# Altium project Display Segmental LCD118x1 DF700543-05 Backlight TB1012S.PrjPCB
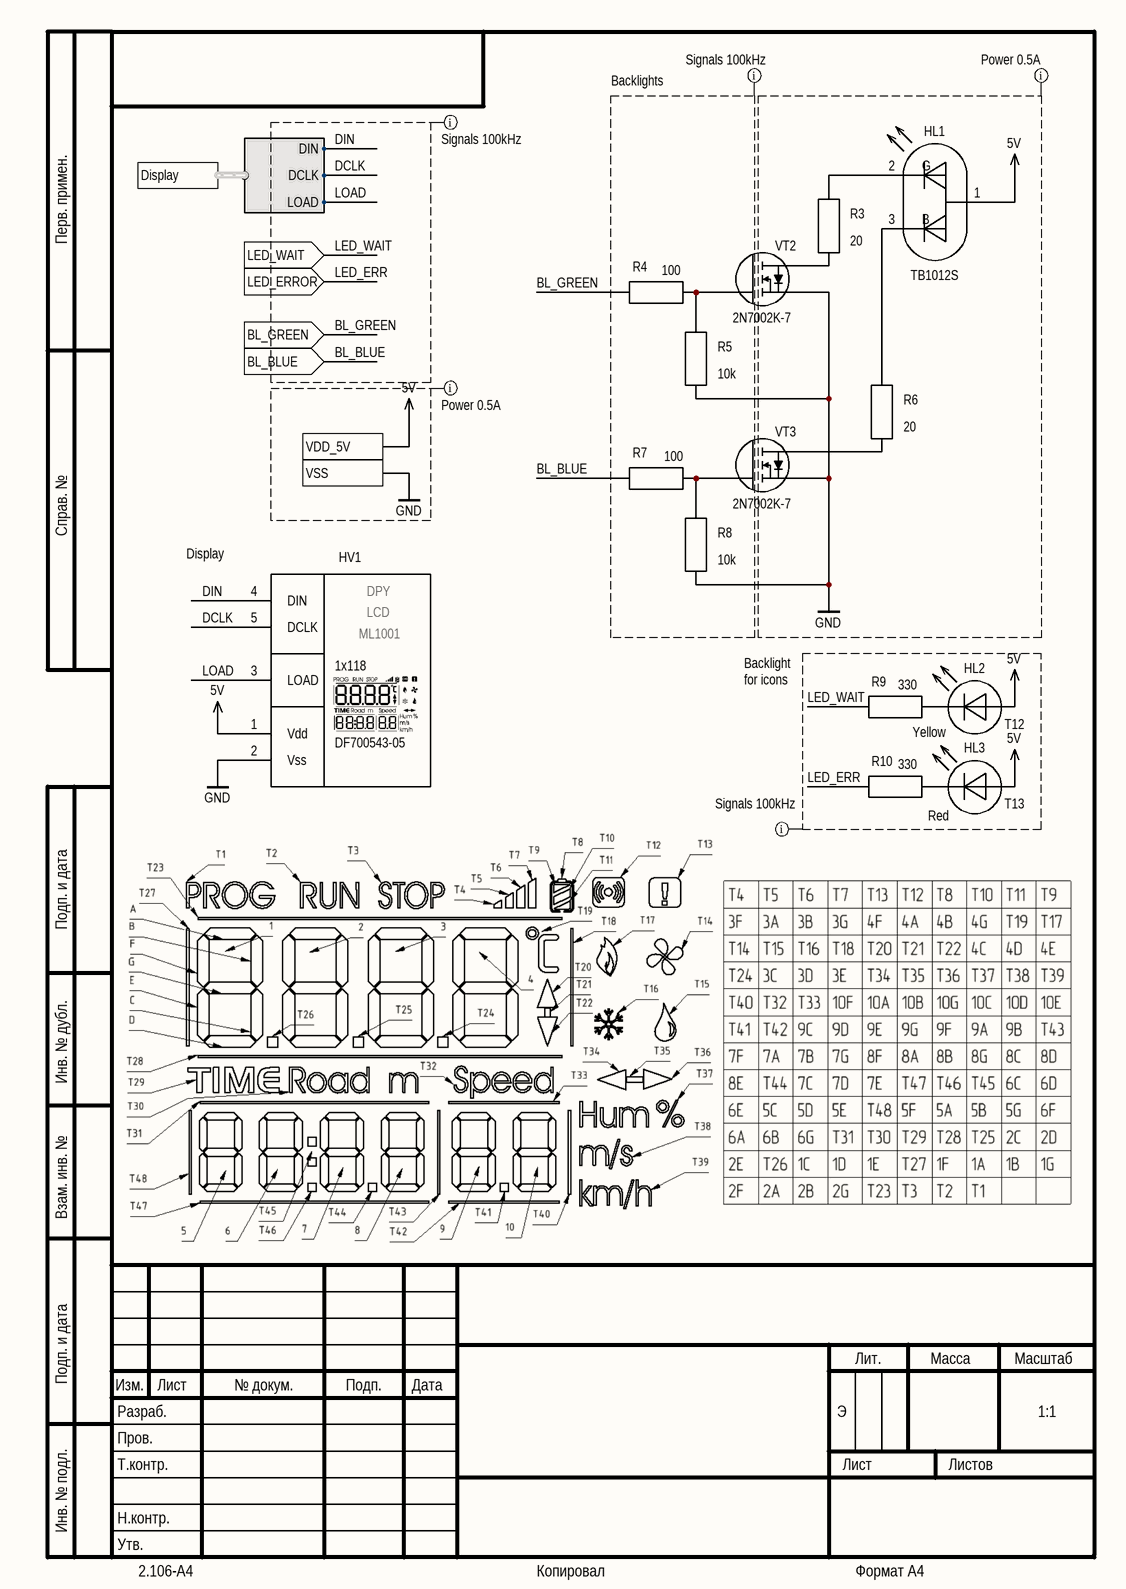
[diagram p0: Display Segmental LCD118x1 DF700543-05 Backlight TB1012S.SchDoc]
1 sheet, 14 parts. Net scope: flat (ports and power ports of the same name join across sheets).
Board file: Display Segmental LCD118x1 DF700543-05 Backlight TB1012S.PcbDoc

## Sheet Display Segmental LCD118x1 DF700543-05 Backlight TB1012S.SchDoc
size 209 x 297 mm; Scale: 1:1; Letter1Column: Э

### Parts
HL1  TB1012S  [DISP BKL LED TB1012S]
HL2  Yellow  [LEDD3TBN]
HL3  Red  [LEDD3TBN]
HV1  DF700543-05  [DISP SEG LCD128 DF700543-05]
R3  20  [RESC3225N]
R4  100  [RESC2012N]
R5  10k  [RESC2012N]
R6  20  [RESC3225N]
R7  100  [RESC2012N]
R8  10k  [RESC2012N]
R9  330  [RESC2012N]
R10  330  [RESC2012N]
VT2  2N7002K-7  [SOT-23-3N]
VT3  2N7002K-7  [SOT-23-3N]

### Ports
BL_BLUE (in), BL_GREEN (in), Display (harness Display), LED_ERROR (in), LED_WAIT (in), VDD_5V, VSS

### Harnesses
Display: DIN, DCLK, LOAD

### Nets
5V: HL1.1(CA) HL2.1(Anode) HL3.1(Anode) HV1.1(Vdd) ; port VDD_5V
GND: HV1.2(Vss) R5.2 R8.2 VT2.2(Source) VT3.2(Source) ; port VSS
BL_BLUE: R7.1 ; port BL_BLUE
BL_GREEN: R4.1 ; port BL_GREEN
DCLK: HV1.5(DCLK) ; port Display.DCLK
DIN: HV1.4(DIN) ; port Display.DIN
LED_ERR: R10.1 ; port LED_ERROR
LED_WAIT: R9.1 ; port LED_WAIT
LOAD: HV1.3(LOAD) ; port Display.LOAD
NetHL1_2: HL1.2(GREEN) R3.1
NetHL1_3: HL1.3(BLUE) R6.1
NetHL2_2: HL2.2(Cathode) R9.2
NetHL3_2: HL3.2(Cathode) R10.2
NetR3_2: R3.2 VT2.3(Drain)
NetR4_2: R4.2 R5.1 VT2.1(Gate)
NetR6_2: R6.2 VT3.3(Drain)
NetR7_2: R7.2 R8.1 VT3.1(Gate)

### Layout directives
net class Signals 100kHz; rule Width Constraint [Pref Width = 0.25mm    Min Width = 0.1mm    Max Width = 0.5mm]; rule Clearance Constraint [Clearance = 0.2mm]; rule Routing Via Style [Pref Size = 1.1mm    Pref Hole Size = 0.5mm]: 5V, (no net found under the mark), BL_BLUE, BL_GREEN, DCLK, DIN, LED_ERR, LED_WAIT, LOAD
net class Power 0.5A; rule Width Constraint [Pref Width = 0.5mm    Min Width = 0.3mm    Max Width = 1mm]; rule Clearance Constraint [Clearance = 0.3mm]; rule Routing Via Style [Pref Size = 1.5mm    Pref Hole Size = 0.8mm]: 5V, GND

### Notes on the sheet
- Backlights
- (near HV1) Display
- Backlight for icons
- (near HL2) T12
- (near HL3) T13
- Перв. примен.
- Справ. №
- Подп. и дата
- Инв. № дубл.
- Взам. инв. №
- Разраб.
- Изм.
- Лист
- № докум.
- Подп.
- Дата
- Лит.
- Масса
- Масштаб
- Пров.
- Т.контр.
- Листов
- Инв. № подл.
- Утв.
- Н.контр.
- 2.106-A4
- Копировал
- Формат А4
- (in symbol DF700543-05) DPY; LCD; 1x118
- (in symbol TB1012S) G; B

### Library data of the parts
HL1 = TB1012S: Display Backlight LED GB CA; Group: Display - Backlight; Color: Green, Blue; Forward Current: 250mA; Forward Voltage: 3.0V; Package: TB1012S; Part name: TB1012S; Operating Temperature: -30°C +70°C; Mounting Type: Through Hole; Dimension: 55.00mm x 33.00mm; Thickness: 3.20mm
HL2 = LTL-4251: LED Yellow TH D3mm; Manufacturer: Lite-On; Forward current: 10mA; Forward voltage: 2.1V; Wavelength: 588nm; Component: LED Indication; Group: Discrete; Package: T-1 (D3); Part name: LTL-4251; Color: Yellow; Operating temperature: -55°C +100°C; Mounting type: Through hole; Dimension: 4.00mm x 3.50mm; Height: 6.25mm
HL3 = LTL-4211: LED Red TH D3mm; Manufacturer: Lite-On; Forward current: 10mA; Forward voltage: 2.1V; Wavelength: 657nm; Component: LED Indication; Group: Discrete; Package: T-1 (D3); Part name: LTL-4211; Color: Red; Operating temperature: -55°C +100°C; Mounting type: Through hole; Dimension: 4.00mm x 3.50mm; Height: 6.25mm
HV1 = DF700543-05: Display Segmental LCD128 Special; Group: Digital - Displays -  Segmental; Forward current: 50mA; Driver: ML1001; Package: DF700543-05; Part name: DF700543-05; Color: Black; Dimension: 48.53mm x 41.00mm; Thickness: 6.00mm; Operating Temperature: -40°C +85°C; Mounting Type: Through Hole
R3 R6 = RC1210JR-0720RL: RESC 20 1210(3225); Manufacturer: Yageo; Group: Discrete - Resistors - Ceramic; Temperature Coefficient: ±100ppm/°C; Tolerance: ±1%; Power: 0.5W; Part name: RC1210JR-0720RL; Type: Thin Film; Package: 1210 (3225); Value: 20; Dimension: 3.10mm x 2.60mm; Thickness: 0.60mm; Operating Temperature: -55°C +155°C; Mounting Type: Surface Mount
R4 R7 = RC0805JR-07100RL: RESC 100 0805(2012); Manufacturer: Yageo; Group: Discrete; Temperature coefficient: ±100ppm/°C; Tolerance: ±5%; Power: 0.125W; Component: Resistor Ceramic; Part name: RC0805JR-07100RL; Type: Thin film; Package: 0805 (2012); Value: 100; Dimension: 2.00mm x 1.25mm; Operating temperature: -55°C +155°C; Mounting type: Surface mount; Height: 0.60mm
R5 R8 = RC0805JR-0710KL: RESC 10k 0805(2012); Manufacturer: Yageo; Group: Discrete; Temperature coefficient: ±100ppm/°C; Tolerance: ±5%; Power: 0.125W; Component: Resistor Ceramic; Part name: RC0805JR-0710KL; Type: Thin film; Package: 0805 (2012); Value: 10k; Dimension: 2.00mm x 1.25mm; Operating temperature: -55°C +155°C; Mounting type: Surface mount; Height: 0.60mm
R9 R10 = RC0805JR-073300RL: RESC 330 0805(2012); Manufacturer: Yageo; Group: Discrete; Temperature coefficient: ±100ppm/°C; Tolerance: ±5%; Power: 0.125W; Component: Resistor Ceramic; Part name: RC0805JR-073300RL; Type: Thin film; Package: 0805 (2012); Value: 330; Dimension: 2.00mm x 1.25mm; Operating temperature: -55°C +155°C; Mounting type: Surface mount; Height: 0.60mm
VT2 VT3 = 2N7002K-7: MOSFET N 0.38A 60V; Manufacturer: Diodes Incorporated; Group: Discrete; Drain current: 380mA; Gate-source voltage: ±20V; Power dissipation: 370mW; Drain-source on-resistance: 2 Ohm; FET type: N-Channel; Component: Transistor FET; Part name: 2N7002K-7; Package: SOT-23-3; Drain-source voltage: 60V; Dimension: 2.90mm x 2.80mm; Operating temperature: -55°C +150°C; Mounting type: Surface mount; Height: 1.00mm